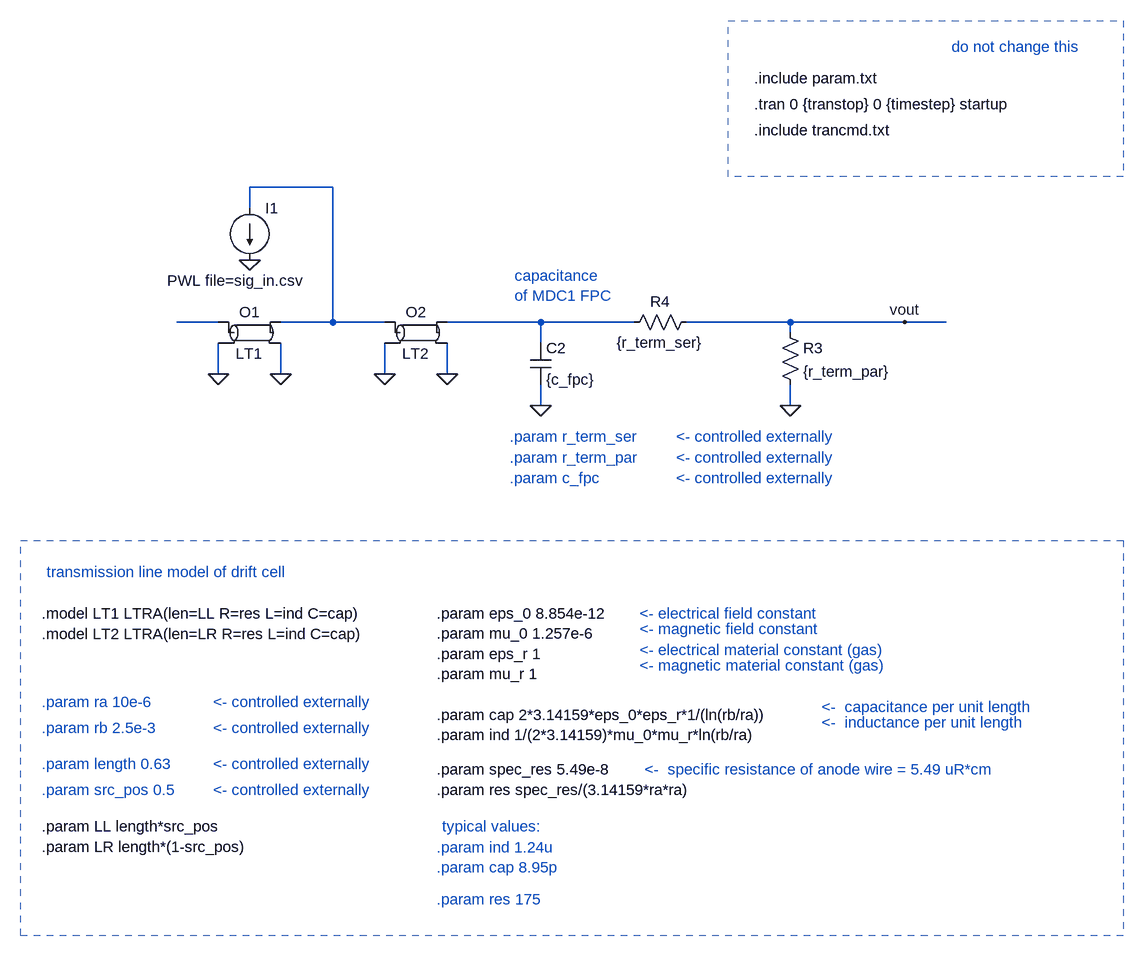
[diagram p0: schematic tline_model.asc]
tline_model.asc, the LTspice schematic file:
Version 4
SHEET 1 3204 1444
WIRE 1984 288 1856 288
WIRE 1856 320 1856 288
WIRE 1808 496 1744 496
WIRE 1984 496 1984 288
WIRE 1984 496 1904 496
WIRE 2064 496 1984 496
WIRE 2304 496 2160 496
WIRE 2448 496 2304 496
WIRE 2688 496 2528 496
WIRE 2864 496 2688 496
WIRE 2928 496 2864 496
WIRE 2688 512 2688 496
WIRE 2304 528 2304 496
WIRE 1808 576 1808 528
WIRE 1904 576 1904 528
WIRE 2064 576 2064 528
WIRE 2160 576 2160 528
WIRE 2304 624 2304 592
WIRE 2688 624 2688 592
FLAG 2864 496 vout
FLAG 1856 400 0
FLAG 2688 624 0
FLAG 2160 576 0
FLAG 2064 576 0
FLAG 1904 576 0
FLAG 1808 576 0
FLAG 2304 624 0
SYMBOL res 2672 496 R0
SYMATTR InstName R3
SYMATTR Value {r_term_par}
SYMBOL res 2544 480 R90
WINDOW 0 0 56 VBottom 2
WINDOW 3 32 56 VTop 2
SYMATTR InstName R4
SYMATTR Value {r_term_ser}
SYMBOL cap 2288 528 R0
SYMATTR InstName C2
SYMATTR Value {c_fpc}
SYMBOL ltline 1856 512 R0
SYMATTR InstName O1
SYMATTR Value LT1
SYMBOL ltline 2112 512 R0
SYMATTR InstName O2
SYMATTR Value LT2
SYMBOL current 1856 320 R0
WINDOW 3 -127 112 Left 2
SYMATTR Value PWL file=sig_in.csv
SYMATTR InstName I1
TEXT 2632 160 Left 2 !.tran 0 {transtop} 0 {timestep} startup
TEXT 2632 120 Left 2 !.include param.txt
TEXT 2632 200 Left 2 !.include trancmd.txt
TEXT 1536 1176 Left 2 ;.param length 0.63
TEXT 1536 976 Left 2 !.model LT2 LTRA(len=LR R=res L=ind C=cap)
TEXT 1536 1216 Left 2 ;.param src_pos 0.5
TEXT 2144 1304 Left 2 ;.param ind 1.24u\n.param cap 8.95p
TEXT 1536 944 Left 2 !.model LT1 LTRA(len=LL R=res L=ind C=cap)
TEXT 1536 1272 Left 2 !.param LL length*src_pos\n.param LR length*(1-src_pos)
TEXT 2144 1384 Left 2 ;.param res 175
TEXT 2264 424 Left 2 ;capacitance \nof MDC1 FPC
TEXT 1544 880 Left 2 ;transmission line model of drift cell
TEXT 1800 1176 Left 2 ;<- controlled externally
TEXT 1800 1216 Left 2 ;<- controlled externally
TEXT 2144 944 Left 2 !.param eps_0 8.854e-12 \n.param mu_0 1.257e-6 \n.param eps_r 1 \n.param mu_r 1 \n \n.param cap 2*3.14159*eps_0*eps_r*1/(ln(rb/ra))\n.param ind 1/(2*3.14159)*mu_0*mu_r*ln(rb/ra)
TEXT 2456 944 Left 2 ;<- electrical field constant
TEXT 2456 968 Left 2 ;<- magnetic field constant
TEXT 2456 1000 Left 2 ;<- electrical material constant (gas)
TEXT 2456 1024 Left 2 ;<- magnetic material constant (gas)
TEXT 2736 1088 Left 2 ;<-  capacitance per unit length
TEXT 2736 1112 Left 2 ;<-  inductance per unit length
TEXT 2144 1216 Left 2 !.param res spec_res/(3.14159*ra*ra)
TEXT 2144 1184 Left 2 !.param spec_res 5.49e-8
TEXT 2464 1184 Left 2 ;<-  specific resistance of anode wire = 5.49 uR*cm
TEXT 2152 1272 Left 2 ;typical values:
TEXT 1536 1080 Left 2 ;.param ra 10e-6
TEXT 1536 1120 Left 2 ;.param rb 2.5e-3
TEXT 1800 1080 Left 2 ;<- controlled externally
TEXT 1800 1120 Left 2 ;<- controlled externally
TEXT 2936 72 Left 2 ;do not change this
TEXT 2512 672 Left 2 ;<- controlled externally
TEXT 2256 672 Left 2 ;.param r_term_ser
TEXT 2512 704 Left 2 ;<- controlled externally
TEXT 2512 736 Left 2 ;<- controlled externally
TEXT 2256 736 Left 2 ;.param c_fpc
TEXT 2256 704 Left 2 ;.param r_term_par
RECTANGLE Normal 1504 832 3200 1440 2
RECTANGLE Normal 3200 272 2592 32 2

The netlist it stands for:
* tline_model.asc
R3 vout 0 {r_term_par}
R4 vout N003 {r_term_ser}
C2 N003 0 {c_fpc}
O1 N002 0 N001 0 LT1
O2 N001 0 N003 0 LT2
I1 N001 0 PWL file=sig_in.csv
.tran 0 {transtop} 0 {timestep} startup
.include param.txt
.include trancmd.txt
* .param length 0.63
.model LT2 LTRA(len=LR R=res L=ind C=cap)
* .param src_pos 0.5
* .param ind 1.24u
* .param cap 8.95p
.model LT1 LTRA(len=LL R=res L=ind C=cap)
.param LL length*src_pos
.param LR length*(1-src_pos)
* .param res 175
* capacitance
* of MDC1 FPC
* transmission line model of drift cell
* <- controlled externally
* <- controlled externally
.param eps_0 8.854e-12
.param mu_0 1.257e-6
.param eps_r 1
.param mu_r 1
.param cap 2*3.14159*eps_0*eps_r*1/(ln(rb/ra))
.param ind 1/(2*3.14159)*mu_0*mu_r*ln(rb/ra)
* <- electrical field constant
* <- magnetic field constant
* <- electrical material constant (gas)
* <- magnetic material constant (gas)
* <-  capacitance per unit length
* <-  inductance per unit length
.param res spec_res/(3.14159*ra*ra)
.param spec_res 5.49e-8
* <-  specific resistance of anode wire = 5.49 uR*cm
* typical values:
* .param ra 10e-6
* .param rb 2.5e-3
* <- controlled externally
* <- controlled externally
* do not change this
* <- controlled externally
* .param r_term_ser
* <- controlled externally
* <- controlled externally
* .param c_fpc
* .param r_term_par
.backanno
.end